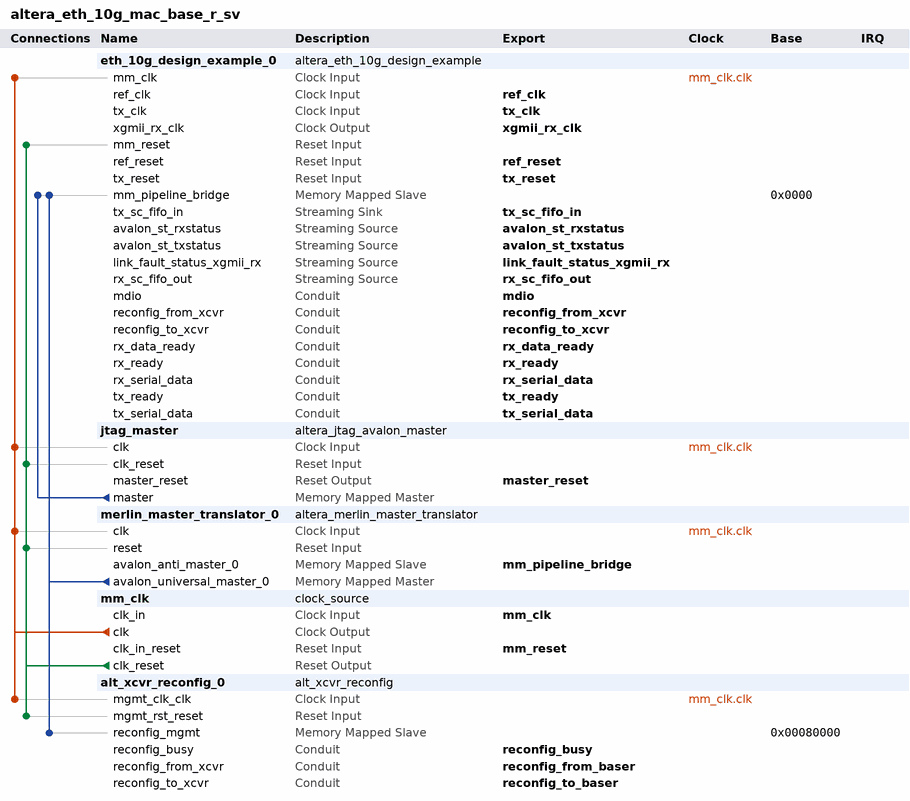
[diagram p0: system contents]
# Platform Designer (Qsys) system altera_eth_10g_mac_base_r_sv, Stratix V Unknown
# Parameters at their usual value, and those the tool derives, are not listed.
package require -exact qsys 14.1
create_system altera_eth_10g_mac_base_r_sv
set_project_property DEVICE_FAMILY {Stratix V}
set_project_property DEVICE Unknown

add_instance eth_10g_design_example_0 altera_eth_10g_design_example 14.1
set_instance_parameter_value eth_10g_design_example_0 DEVICE_FAMILY_TOP {Stratix V}
set_instance_parameter_value eth_10g_design_example_0 ENABLE_MAC_LOOPBACK {10Gbps Ethernet MAC with LoopBack Enabled}
set_instance_parameter_value eth_10g_design_example_0 CHOOSE_MDIO_2_WIRE_SERIAL_INT 0
set_instance_parameter_value eth_10g_design_example_0 PHY_IP 1
set_instance_parameter_value eth_10g_design_example_0 CHOOSE_FIFO 0
set_instance_parameter_value eth_10g_design_example_0 ENABLE_TIMESTAMPING 0
set_instance_parameter_value eth_10g_design_example_0 ENABLE_PTP_1STEP 0
set_instance_parameter_value eth_10g_design_example_0 TSTAMP_FP_WIDTH 4
set_instance_parameter_value eth_10g_design_example_0 PREAMBLE_PASSTHROUGH 0
set_instance_parameter_value eth_10g_design_example_0 ENABLE_PFC 0
set_instance_parameter_value eth_10g_design_example_0 PFC_PRIORITY_NUM 8
set_instance_parameter_value eth_10g_design_example_0 DATAPATH_OPTION 3
set_instance_parameter_value eth_10g_design_example_0 ENABLE_SUPP_ADDR 1
set_instance_parameter_value eth_10g_design_example_0 INSTANTIATE_TX_CRC 1
set_instance_parameter_value eth_10g_design_example_0 INSTANTIATE_STATISTICS 1
set_instance_parameter_value eth_10g_design_example_0 REGISTER_BASED_STATISTICS 0
set_instance_parameter_value eth_10g_design_example_0 ENABLE_1G10G_MAC 0
set_instance_parameter_value eth_10g_design_example_0 ENABLE_UNIDIRECTIONAL 0
set_instance_parameter_value eth_10g_design_example_0 MDIO_MDC_DIVISOR 32
set_instance_parameter_value eth_10g_design_example_0 SYNC_TX_FIFO_SYMBOLS_PER_BEAT 8
set_instance_parameter_value eth_10g_design_example_0 SYNC_TX_FIFO_BITS_PER_SYMBOL 8
set_instance_parameter_value eth_10g_design_example_0 SYNC_TX_FIFO_DEPTH 512
set_instance_parameter_value eth_10g_design_example_0 SYNC_TX_FIFO_ERROR_WIDTH 1
set_instance_parameter_value eth_10g_design_example_0 SYNC_TX_USE_PACKETS 1
set_instance_parameter_value eth_10g_design_example_0 SYNC_TX_USE_FILL 1
set_instance_parameter_value eth_10g_design_example_0 SYNC_TX_USE_STORE_AND_FORWARD 1
set_instance_parameter_value eth_10g_design_example_0 SYNC_TX_USE_ALMOST_FULL 0
set_instance_parameter_value eth_10g_design_example_0 SYNC_TX_USE_ALMOST_EMPTY 0
set_instance_parameter_value eth_10g_design_example_0 SYNC_RX_FIFO_SYMBOLS_PER_BEAT 8
set_instance_parameter_value eth_10g_design_example_0 SYNC_RX_FIFO_BITS_PER_SYMBOL 8
set_instance_parameter_value eth_10g_design_example_0 SYNC_RX_FIFO_DEPTH 512
set_instance_parameter_value eth_10g_design_example_0 SYNC_RX_FIFO_ERROR_WIDTH 6
set_instance_parameter_value eth_10g_design_example_0 SYNC_RX_USE_PACKETS 1
set_instance_parameter_value eth_10g_design_example_0 SYNC_RX_USE_FILL 1
set_instance_parameter_value eth_10g_design_example_0 SYNC_RX_USE_STORE_AND_FORWARD 1
set_instance_parameter_value eth_10g_design_example_0 SYNC_RX_USE_ALMOST_FULL 1
set_instance_parameter_value eth_10g_design_example_0 SYNC_RX_USE_ALMOST_EMPTY 1
set_instance_parameter_value eth_10g_design_example_0 ASYNC_TX_FIFO_SYMBOLS_PER_BEAT 8
set_instance_parameter_value eth_10g_design_example_0 ASYNC_TX_FIFO_BITS_PER_SYMBOL 8
set_instance_parameter_value eth_10g_design_example_0 ASYNC_TX_FIFO_DEPTH 16
set_instance_parameter_value eth_10g_design_example_0 ASYNC_TX_FIFO_ERROR_WIDTH 1
set_instance_parameter_value eth_10g_design_example_0 ASYNC_TX_USE_PKT 1
set_instance_parameter_value eth_10g_design_example_0 ASYNC_TX_USE_SINK_FILL 0
set_instance_parameter_value eth_10g_design_example_0 ASYNC_TX_USE_SRC_FILL 0
set_instance_parameter_value eth_10g_design_example_0 ASYNC_RX_FIFO_SYMBOLS_PER_BEAT 8
set_instance_parameter_value eth_10g_design_example_0 ASYNC_RX_FIFO_BITS_PER_SYMBOL 8
set_instance_parameter_value eth_10g_design_example_0 ASYNC_RX_FIFO_DEPTH 16
set_instance_parameter_value eth_10g_design_example_0 ASYNC_RX_FIFO_ERROR_WIDTH 6
set_instance_parameter_value eth_10g_design_example_0 ASYNC_RX_USE_PKT 1
set_instance_parameter_value eth_10g_design_example_0 ASYNC_RX_USE_SINK_FILL 0
set_instance_parameter_value eth_10g_design_example_0 ASYNC_RX_USE_SRC_FILL 0
set_instance_parameter_value eth_10g_design_example_0 BASER_INTERFACE 0
set_instance_parameter_value eth_10g_design_example_0 BASER_PLL_TYPE CMU
set_instance_parameter_value eth_10g_design_example_0 BASER_STARTING_CHANNEL_NUMBER 0
set_instance_parameter_value eth_10g_design_example_0 BASER_REF_CLK_FREQ {644.53125 MHz}
set_instance_parameter_value eth_10g_design_example_0 BASER_TRANSMITTER_TERMINATION OCT_100_OHMS
set_instance_parameter_value eth_10g_design_example_0 BASER_PRE_EMPHASIS_PRE_TAP 0
set_instance_parameter_value eth_10g_design_example_0 BASER_PRE_EMPHASIS_PRE_TAP_POLARITY 0
set_instance_parameter_value eth_10g_design_example_0 BASER_PRE_EMPHASIS_FIRST_POST_TAP 5
set_instance_parameter_value eth_10g_design_example_0 BASER_PRE_EMPHASIS_SECOND_POST_TAP 0
set_instance_parameter_value eth_10g_design_example_0 BASER_PRE_EMPHASIS_SECOND_POST_TAP_POLARITY 0
set_instance_parameter_value eth_10g_design_example_0 BASER_TRANSMITTER_VOD 1
set_instance_parameter_value eth_10g_design_example_0 BASER_RECEIVER_TERMINATION OCT_100_OHMS
set_instance_parameter_value eth_10g_design_example_0 BASER_RECEIVER_DC_GAIN 0
set_instance_parameter_value eth_10g_design_example_0 BASER_RECEIVER_STATIC_EQUALIZER 14
set_instance_parameter_value eth_10g_design_example_0 BASER_EXT_PMA_CONTROL_CONF 0
set_instance_parameter_value eth_10g_design_example_0 BASER_ENA_ADD_CONTROL_STAT 0
set_instance_parameter_value eth_10g_design_example_0 BASER_RECOVERED_CLK_OUT 0
set_instance_parameter_value eth_10g_design_example_0 XAUI_STARTING_CHANNEL_NUMBER 0
set_instance_parameter_value eth_10g_design_example_0 starting_channel_number 0
set_instance_parameter_value eth_10g_design_example_0 interface_type {Soft XAUI}
set_instance_parameter_value eth_10g_design_example_0 soft_xaui_cfg {Only Soft XAUI is supported for this device.}
set_instance_parameter_value eth_10g_design_example_0 hard_xaui_cfg {Only Hard XAUI is supported for this device.}
set_instance_parameter_value eth_10g_design_example_0 gui_pll_type CMU
set_instance_parameter_value eth_10g_design_example_0 en_synce_support 0
set_instance_parameter_value eth_10g_design_example_0 use_control_and_status_ports 0
set_instance_parameter_value eth_10g_design_example_0 external_pma_ctrl_reconf 0
set_instance_parameter_value eth_10g_design_example_0 dyn_reconf 0
set_instance_parameter_value eth_10g_design_example_0 recovered_clk_out 0
set_instance_parameter_value eth_10g_design_example_0 number_of_interfaces 1
set_instance_parameter_value eth_10g_design_example_0 use_rx_rate_match 0
set_instance_parameter_value eth_10g_design_example_0 tx_termination OCT_100_OHMS
set_instance_parameter_value eth_10g_design_example_0 tx_vod_selection 4
set_instance_parameter_value eth_10g_design_example_0 tx_preemp_pretap 0
set_instance_parameter_value eth_10g_design_example_0 tx_preemp_pretap_inv false
set_instance_parameter_value eth_10g_design_example_0 tx_preemp_tap_1 0
set_instance_parameter_value eth_10g_design_example_0 tx_preemp_tap_2 0
set_instance_parameter_value eth_10g_design_example_0 tx_preemp_tap_2_inv false
set_instance_parameter_value eth_10g_design_example_0 rx_common_mode 0.82v
set_instance_parameter_value eth_10g_design_example_0 rx_termination OCT_100_OHMS
set_instance_parameter_value eth_10g_design_example_0 rx_eq_dc_gain 0
set_instance_parameter_value eth_10g_design_example_0 rx_eq_ctrl 0
set_instance_parameter_value eth_10g_design_example_0 pll_external_enable 0

add_instance jtag_master altera_jtag_avalon_master 14.1

add_instance merlin_master_translator_0 altera_merlin_master_translator 14.1
set_instance_parameter_value merlin_master_translator_0 AV_ADDRESS_W 19
set_instance_parameter_value merlin_master_translator_0 AV_DATA_W 32
set_instance_parameter_value merlin_master_translator_0 AV_BURSTCOUNT_W 3
set_instance_parameter_value merlin_master_translator_0 AV_BYTEENABLE_W 4
set_instance_parameter_value merlin_master_translator_0 UAV_ADDRESS_W 32
set_instance_parameter_value merlin_master_translator_0 UAV_BURSTCOUNT_W 3
set_instance_parameter_value merlin_master_translator_0 AV_READLATENCY 0
set_instance_parameter_value merlin_master_translator_0 AV_WRITE_WAIT 0
set_instance_parameter_value merlin_master_translator_0 AV_READ_WAIT 0
set_instance_parameter_value merlin_master_translator_0 AV_DATA_HOLD 0
set_instance_parameter_value merlin_master_translator_0 AV_SETUP_WAIT 0
set_instance_parameter_value merlin_master_translator_0 USE_READDATA 1
set_instance_parameter_value merlin_master_translator_0 USE_WRITEDATA 1
set_instance_parameter_value merlin_master_translator_0 USE_READ 1
set_instance_parameter_value merlin_master_translator_0 USE_WRITE 1
set_instance_parameter_value merlin_master_translator_0 USE_BEGINBURSTTRANSFER 0
set_instance_parameter_value merlin_master_translator_0 USE_BEGINTRANSFER 0
set_instance_parameter_value merlin_master_translator_0 USE_BYTEENABLE 0
set_instance_parameter_value merlin_master_translator_0 USE_CHIPSELECT 0
set_instance_parameter_value merlin_master_translator_0 USE_ADDRESS 1
set_instance_parameter_value merlin_master_translator_0 USE_BURSTCOUNT 0
set_instance_parameter_value merlin_master_translator_0 USE_DEBUGACCESS 0
set_instance_parameter_value merlin_master_translator_0 USE_CLKEN 0
set_instance_parameter_value merlin_master_translator_0 USE_READDATAVALID 0
set_instance_parameter_value merlin_master_translator_0 USE_WAITREQUEST 1
set_instance_parameter_value merlin_master_translator_0 USE_LOCK 0
set_instance_parameter_value merlin_master_translator_0 USE_READRESPONSE 0
set_instance_parameter_value merlin_master_translator_0 USE_WRITERESPONSE 0
set_instance_parameter_value merlin_master_translator_0 AV_SYMBOLS_PER_WORD 4
set_instance_parameter_value merlin_master_translator_0 AV_ADDRESS_SYMBOLS 1
set_instance_parameter_value merlin_master_translator_0 AV_BURSTCOUNT_SYMBOLS 1
set_instance_parameter_value merlin_master_translator_0 AV_CONSTANT_BURST_BEHAVIOR 0
set_instance_parameter_value merlin_master_translator_0 UAV_CONSTANT_BURST_BEHAVIOR 0
set_instance_parameter_value merlin_master_translator_0 AV_LINEWRAPBURSTS 0
set_instance_parameter_value merlin_master_translator_0 AV_MAX_PENDING_READ_TRANSACTIONS 0
set_instance_parameter_value merlin_master_translator_0 AV_BURSTBOUNDARIES 0
set_instance_parameter_value merlin_master_translator_0 AV_INTERLEAVEBURSTS 0
set_instance_parameter_value merlin_master_translator_0 AV_BITS_PER_SYMBOL 8
set_instance_parameter_value merlin_master_translator_0 AV_ISBIGENDIAN 0
set_instance_parameter_value merlin_master_translator_0 AV_ADDRESSGROUP 0
set_instance_parameter_value merlin_master_translator_0 UAV_ADDRESSGROUP 0
set_instance_parameter_value merlin_master_translator_0 AV_REGISTEROUTGOINGSIGNALS 0
set_instance_parameter_value merlin_master_translator_0 AV_REGISTERINCOMINGSIGNALS 0
set_instance_parameter_value merlin_master_translator_0 AV_ALWAYSBURSTMAXBURST 0

add_instance mm_clk clock_source 14.1
set_instance_parameter_value mm_clk clockFrequency 50000000

add_instance alt_xcvr_reconfig_0 alt_xcvr_reconfig 14.1
set_instance_parameter_value alt_xcvr_reconfig_0 device_family {Stratix V}
set_instance_parameter_value alt_xcvr_reconfig_0 number_of_reconfig_interfaces 2
set_instance_parameter_value alt_xcvr_reconfig_0 enable_analog 1
set_instance_parameter_value alt_xcvr_reconfig_0 enable_adce 0

# connections
add_connection mm_clk.clk alt_xcvr_reconfig_0.mgmt_clk_clk clock
add_connection mm_clk.clk eth_10g_design_example_0.mm_clk clock
add_connection mm_clk.clk jtag_master.clk clock
add_connection mm_clk.clk merlin_master_translator_0.clk clock
add_connection mm_clk.clk_reset alt_xcvr_reconfig_0.mgmt_rst_reset reset
add_connection mm_clk.clk_reset eth_10g_design_example_0.mm_reset reset
add_connection mm_clk.clk_reset jtag_master.clk_reset reset
add_connection mm_clk.clk_reset merlin_master_translator_0.reset reset
add_connection jtag_master.master eth_10g_design_example_0.mm_pipeline_bridge avalon
set_connection_parameter_value jtag_master.master/eth_10g_design_example_0.mm_pipeline_bridge baseAddress 0x0000
add_connection merlin_master_translator_0.avalon_universal_master_0 alt_xcvr_reconfig_0.reconfig_mgmt avalon
set_connection_parameter_value merlin_master_translator_0.avalon_universal_master_0/alt_xcvr_reconfig_0.reconfig_mgmt baseAddress 0x00080000
add_connection merlin_master_translator_0.avalon_universal_master_0 eth_10g_design_example_0.mm_pipeline_bridge avalon
set_connection_parameter_value merlin_master_translator_0.avalon_universal_master_0/eth_10g_design_example_0.mm_pipeline_bridge baseAddress 0x0000

# exported interfaces
add_interface ref_clk clock sink
set_interface_property ref_clk EXPORT_OF eth_10g_design_example_0.ref_clk
add_interface ref_reset reset sink
set_interface_property ref_reset EXPORT_OF eth_10g_design_example_0.ref_reset
add_interface tx_clk clock sink
set_interface_property tx_clk EXPORT_OF eth_10g_design_example_0.tx_clk
add_interface tx_reset reset sink
set_interface_property tx_reset EXPORT_OF eth_10g_design_example_0.tx_reset
add_interface xgmii_rx_clk clock source
set_interface_property xgmii_rx_clk EXPORT_OF eth_10g_design_example_0.xgmii_rx_clk
add_interface avalon_st_rxstatus avalon_streaming source
set_interface_property avalon_st_rxstatus EXPORT_OF eth_10g_design_example_0.avalon_st_rxstatus
add_interface link_fault_status_xgmii_rx avalon_streaming source
set_interface_property link_fault_status_xgmii_rx EXPORT_OF eth_10g_design_example_0.link_fault_status_xgmii_rx
add_interface rx_serial_data conduit end
set_interface_property rx_serial_data EXPORT_OF eth_10g_design_example_0.rx_serial_data
add_interface tx_serial_data conduit end
set_interface_property tx_serial_data EXPORT_OF eth_10g_design_example_0.tx_serial_data
add_interface rx_ready conduit end
set_interface_property rx_ready EXPORT_OF eth_10g_design_example_0.rx_ready
add_interface tx_ready conduit end
set_interface_property tx_ready EXPORT_OF eth_10g_design_example_0.tx_ready
add_interface tx_sc_fifo_in avalon_streaming sink
set_interface_property tx_sc_fifo_in EXPORT_OF eth_10g_design_example_0.tx_sc_fifo_in
add_interface rx_sc_fifo_out avalon_streaming source
set_interface_property rx_sc_fifo_out EXPORT_OF eth_10g_design_example_0.rx_sc_fifo_out
add_interface mdio conduit end
set_interface_property mdio EXPORT_OF eth_10g_design_example_0.mdio
add_interface mm_clk clock sink
set_interface_property mm_clk EXPORT_OF mm_clk.clk_in
add_interface mm_reset reset sink
set_interface_property mm_reset EXPORT_OF mm_clk.clk_in_reset
add_interface avalon_st_txstatus avalon_streaming source
set_interface_property avalon_st_txstatus EXPORT_OF eth_10g_design_example_0.avalon_st_txstatus
add_interface mm_pipeline_bridge avalon slave
set_interface_property mm_pipeline_bridge EXPORT_OF merlin_master_translator_0.avalon_anti_master_0
add_interface reconfig_to_xcvr conduit end
set_interface_property reconfig_to_xcvr EXPORT_OF eth_10g_design_example_0.reconfig_to_xcvr
add_interface reconfig_from_xcvr conduit end
set_interface_property reconfig_from_xcvr EXPORT_OF eth_10g_design_example_0.reconfig_from_xcvr
add_interface reconfig_busy conduit end
set_interface_property reconfig_busy EXPORT_OF alt_xcvr_reconfig_0.reconfig_busy
add_interface reconfig_to_baser conduit end
set_interface_property reconfig_to_baser EXPORT_OF alt_xcvr_reconfig_0.reconfig_to_xcvr
add_interface reconfig_from_baser conduit end
set_interface_property reconfig_from_baser EXPORT_OF alt_xcvr_reconfig_0.reconfig_from_xcvr
add_interface rx_data_ready conduit end
set_interface_property rx_data_ready EXPORT_OF eth_10g_design_example_0.rx_data_ready
add_interface master_reset reset source
set_interface_property master_reset EXPORT_OF jtag_master.master_reset

set_interconnect_requirement {$system} qsys_mm.clockCrossingAdapter HANDSHAKE
set_interconnect_requirement {$system} qsys_mm.maxAdditionalLatency 1

save_system altera_eth_10g_mac_base_r_sv.qsys
